# Altium schematic sheet Power Supply.SchDoc
size A4; SheetNumber: 2; SheetTotal: 3
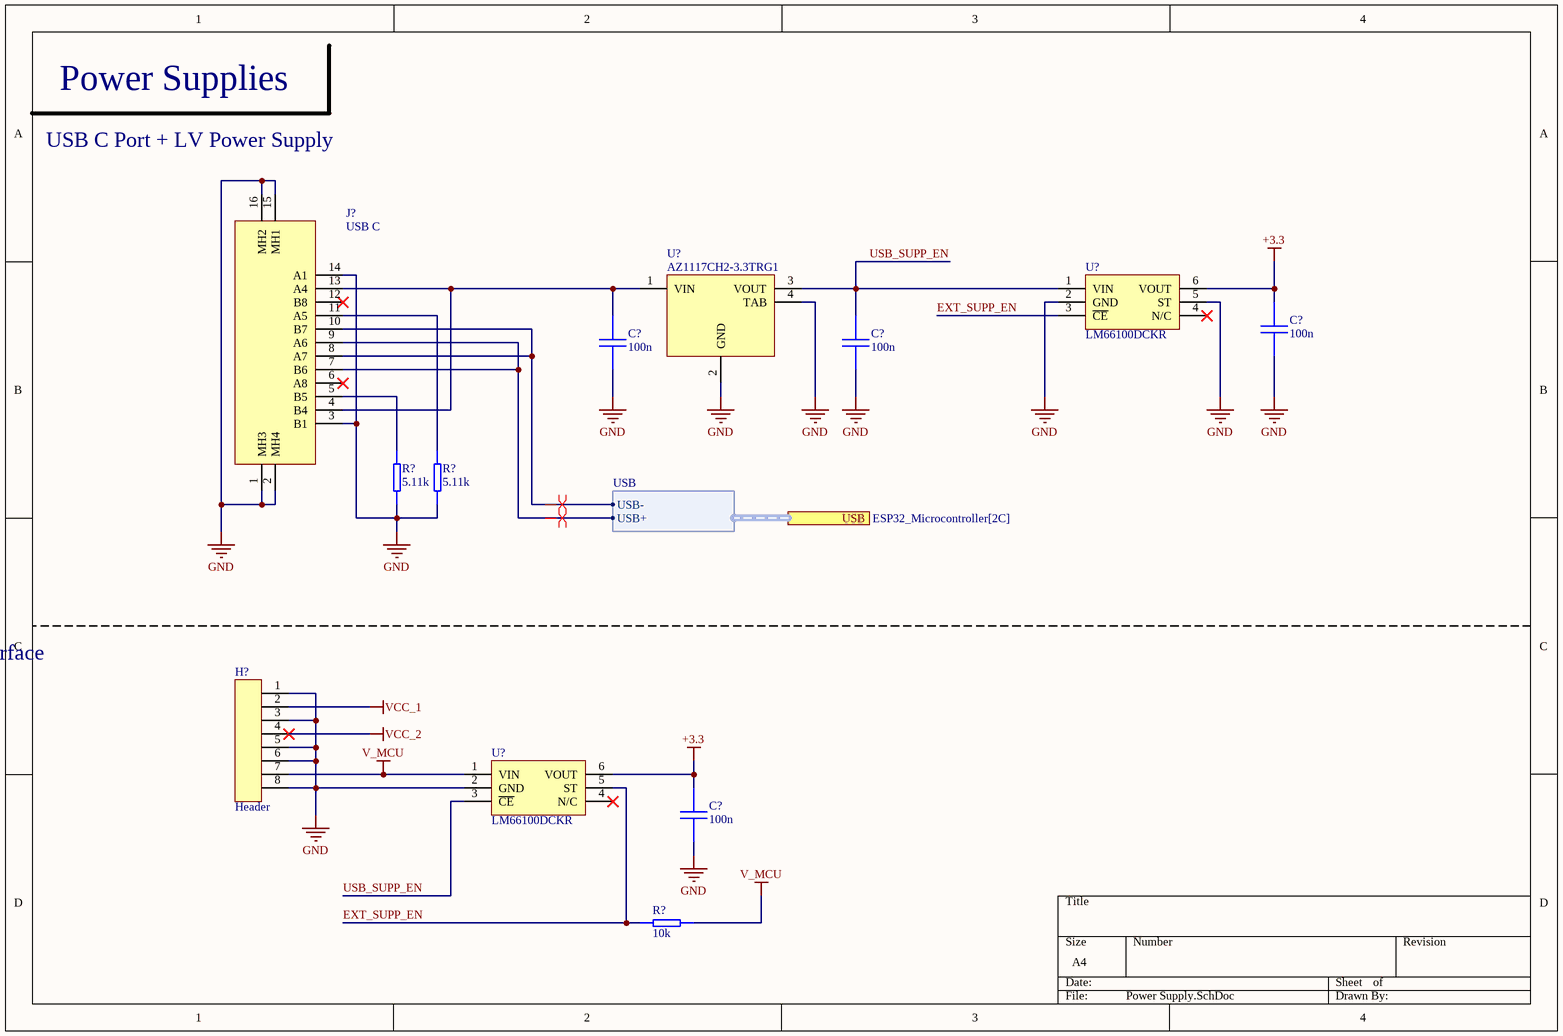
[diagram p0: Power Supply.SchDoc]

## Parts
(Parts that share a designator on the sheet are numbered #1, #2 ... from top to bottom, then left to right.)
C?#1  100n  [CAP0805]
C?#2  100n  [CAP0805]
C?#3  100n  [CAP0805]
C?#4  100n  [CAP0805]
H?  Header  [Header_1X8]
J?  USB C  [USB TYPE C 12 PIN]
R?#1  5.11k  [RESC0805]
R?#2  5.11k  [RESC0805]
R?#3  10k  [RESC0805]
U?#1  AZ1117CH2-3.3TRG1  [SOT223]
U?#2  LM66100DCKR  [SC70-6]
U?#3  LM66100DCKR  [SC70-6]

## Ports
USB (harness USB, see ESP32_Microcontroller[2C])

## Harnesses
USB: USB-, USB+

## Nets
+3.3: C?#1.1 C?#4.1 U?#2.6(VOUT) U?#3.6(VOUT)
GND: C?#1.2 C?#2.2 C?#3.2 C?#4.2 H?.1 H?.3 H?.5 H?.6 H?.8 J?.1(MH3) J?.2(MH4) J?.3(B1) J?.14(A1) J?.15(MH1) J?.16(MH2) R?#1.1 R?#2.1 U?#1.2(GND) U?#1.4(TAB) U?#2.2(GND) U?#2.5(ST) U?#3.2(GND)
V_MCU: H?.7 R?#3.2 U?#3.1(VIN)
VCC_1: H?.2
VCC_2: H?.4
EXT_SUPP_EN: R?#3.1 U?#2.3(~{CE}) U?#3.5(ST)
USB_SUPP_EN: C?#3.1 U?#1.3(VOUT) U?#2.1(VIN) U?#3.3(~{CE})
NetC?#2_1: C?#2.1 J?.4(B4) J?.13(A4) U?#1.1(VIN)
NetJ?_5: J?.5(B5) R?#1.2
NetJ?_7: J?.7(B6) J?.9(A6) ; port USB.USB+
NetJ?_8: J?.8(A7) J?.10(B7) ; port USB.USB-
NetJ?_11: J?.11(A5) R?#2.2

Not connected (* = marked no-connect by the designer): J? 6(A8)* 12(B8)*; U?#2 4(N/C)*; U?#3 4(N/C)*

## Layout directives
differential pair: NetJ?_7, NetJ?_8

## Notes on the sheet
- Power Supplies
- USB C Port + LV Power Supply
- Power Interface

## Library data of the parts
C?#1-C?#4 = Capacitor - Non Polarized: Non Polarized Capacitor
H? = 8-Pin Header: System: Connector
J? = USB Type C Connector 12 Pin
R?#1-R?#3 = Resistor
U?#1 = AZ1117CH2-3.3TRG1_1: 3.3V Linear Voltage Regulator
U?#2 U?#3 = LM66100DCKR: 5.5-V, 1.5-A 79-mΩ, Low IQ Ideal Diode With Input Polarity Protection; Manufacturer_Name: Texas Instruments; Datasheet Link: http://www.ti.com/lit/gpn/LM66100; Height: 1.1mm; Manufacturer_Part_Number: LM66100DCKR; Mouser Part Number: 595-LM66100DCKR; Mouser Price/Stock: https://www.mouser.co.uk/ProductDetail/Texas-Instruments/LM66100DCKR?qs=vLWxofP3U2y2yPPrXoBBoA%3D%3D; Arrow Part Number: LM66100DCKR; Arrow Price/Stock: https://www.arrow.com/en/products/lm66100dckr/texas-instruments?region=nac